# Altium schematic sheet BPS_PowerSupply_v1-0.SchDoc
size A3
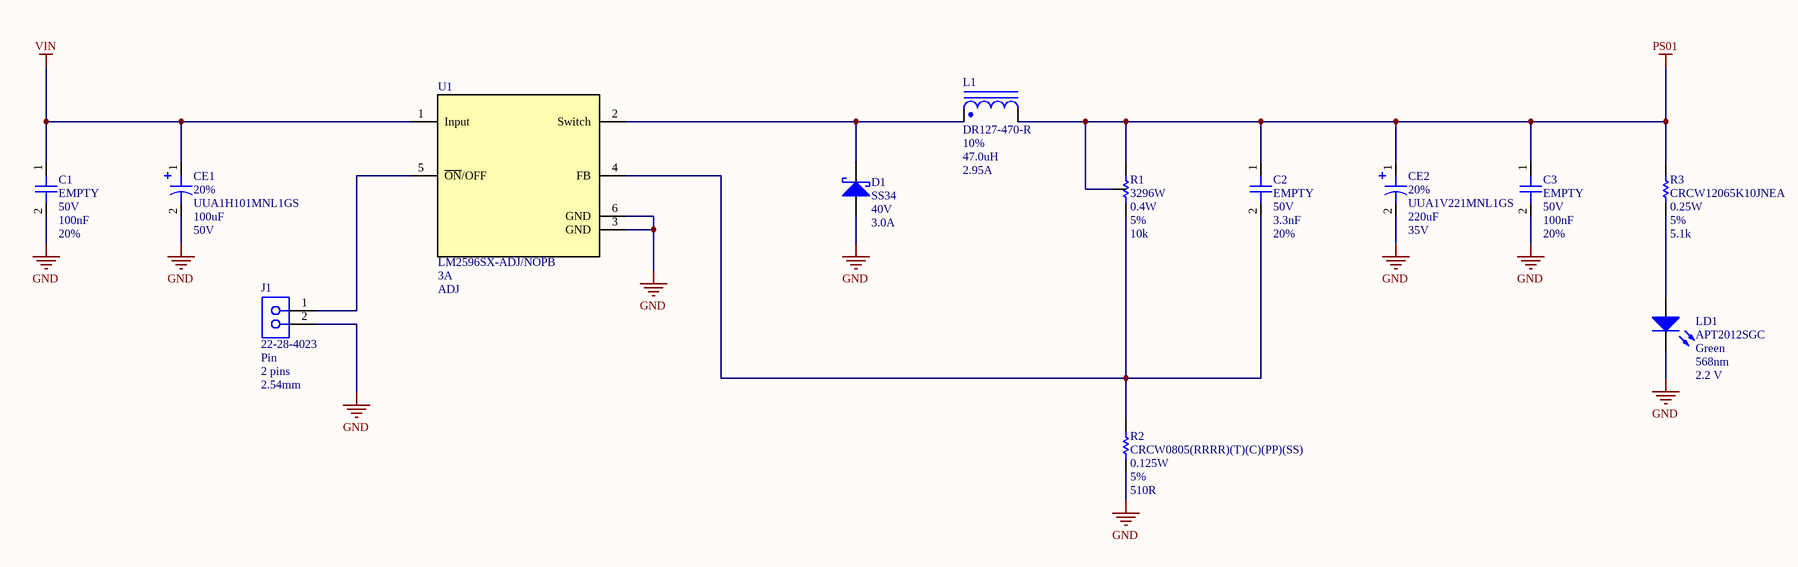
[diagram p0: BPS_PowerSupply_v1-0.SchDoc]

## Parts
C1  value 100nF  PartNumber1: EMPTY  Voltage: 50V  Tolerance: 20%  [Cap0805]  (hidden comment: WCAP-CSGP (0805))
C2  value 3.3nF  PartNumber1: EMPTY  Voltage: 50V  Tolerance: 20%  [Cap0805]  (hidden comment: WCAP-CSGP (0805))
C3  value 100nF  PartNumber1: EMPTY  Voltage: 50V  Tolerance: 20%  [Cap0805]  (hidden comment: WCAP-CSGP (0805))
CE1  value 100uF  Tolerance: 20%  PartNumber1: UUA1H101MNL1GS  Voltage: 50V  [10.0dia(10.0)]  (hidden comment: 50V 100uF)
CE2  value 220uF  Tolerance: 20%  PartNumber1: UUA1V221MNL1GS  Voltage: 35V  [10.0dia(10.0)]  (hidden comment: 35V 220uF)
D1  Vrrm: 40V  If: 3.0A  [DO-214AA]  (hidden comment: SS34)
J1  Type: Pin  Pins: 2 pins  Pitch: 2.54mm  [CONSIL02STRMALE_100_100]  (hidden comment: 22-28-4023)
L1  value 47.0uH  PartNumber1: DR127-470-R  Tolerance: 10%  Current: 2.95A  [DR127]  (hidden comment: DR127)
LD1  Colour: Green  Wavelength: 568nm  Vled: 2.2 V  [LED0805]  (hidden comment: APT2012SGC)
R1  value 10k  Power: 0.4W  Tolerance: 5%  [3296W]  (hidden comment: 3296W)
R2  value 510R  PartNumber1: CRCW0805(RRRR)(T)(C)(PP)(SS)  Power: 0.125W  Tolerance: 5%  [RES0805]  (hidden comment: Chip Resistor)
R3  value 5.1k  PartNumber1: CRCW12065K10JNEA  Power: 0.25W  Tolerance: 5%  [RES1206]  (hidden comment: Chip Resistor)
U1  Current: 3A  Voltage: ADJ  [TO-263-5]  (hidden comment: LM2596SX-ADJ/NOPB)

## Nets
GND: C1.2 C3.2 CE1.2 CE2.2 D1.A J1.2 LD1.K R2.1 U1.3(GND) U1.6(GND)
PS01: C2.1 C3.1 CE2.1 L1.2 R1.2 R1.3 R3.2
VIN: C1.1 CE1.1 U1.1(Input)
NetC2_2: C2.2 R1.1 R2.2 U1.4(FB)
NetD1_K: D1.K L1.1 U1.2(Switch)
NetJ1_1: J1.1 U1.5(~{ON}/OFF)
NetLD1_A: LD1.A R3.1

## Notes on the sheet
- Title
- Author
- Checked By
- Size:
- Revision:
- A3
- Date:
- Project
- Time:
- Sheet
- of
- File:

## Library data of the parts
C1-C3 = WCAP-CSGP (0805): Surface Mount Multilayer Ceramic Chip Capacitors  for Commercial Applications; Manufacturer1: Wurth; Published: 19-Jun-2016; LatestRevisionDate: 19-Jun-2016; Publisher: Lucas Moraes; PackageReference: CAP0805; PackageDescription: CAP0805;2 Leads
CE1 = 50V 100uF: Electrolytic Capacitor SMD; Manufacturer1: Nichicon; Code: 101; Published: 05-Sep-2021; LatestRevisionDate: 05-Sep-2021; PackageReference: 8.0dia(10.0); Publisher: Lucas Moraes; PackageDescription: 10.0dia(10.0)2 leads; LatestRevisionNote: Created
CE2 = 35V 220uF: Electrolytic Capacitor SMD; Manufacturer1: Nichicon; Code: 221; Published: 06-Sep-2021; LatestRevisionDate: 06-Sep-2021; PackageReference: 10.0dia(10.0); Publisher: Lucas Moraes; PackageDescription: 10.0dia(10.0);2 leads; LatestRevisionNote: Created
D1 = SS34: Schottky Barrier Rectifiers 40V 3.0A; Manufacturer1: On Semiconductor; Vf: 0.85V; Published: 24-May-2022; LatestRevisionDate: 20-Jun-2016; PackageReference: DO-214AA; Publisher: Lucas Moraes; PackageDescription: DO-214AA; 2 Leads; PartNumber1: SS34
J1 = 22-28-4023: Headers & Wire Housings 02 MODII HDR SRST B/A .100CL; Manufacturer1: Molex; LastRevisionNote: Created; Gender: Male; Published: 15-Set-2017; LatestRevisionDate: 27-Mar-2023; PackageReference: CONSIL02STRMALE_100_100; Publisher: Lucas Moraes; PackageDescription: CONSIL02STRMALE_100_100; 2 Leads; PartNumber1: 22-28-4023
L1 = DR127: High power density, high efficiency, low profile shielded drum core power inductors; Manufacturer1: Coiltronics / Eaton; LatestRevisionDate: 05-Apr-2023; PackageReference: DR127; Publisher: Lucas Moraes; PackageDescription: DR127; 2 Leads; Published: 05-Apr-2023; Datasheet: https://br.mouser.com/datasheet/2/87/eaton-dr-high-power-density-high-efficiency-shield-1608690.pdf
LD1 = APT2012SGC: Standard LEDs - SMD 0805 Green; Manufacturer1: Kingbright; LastRevisionNote: Created; Published: 29-Dec-2016; PackageReference: LED0805; Publisher: Lucas Moraes; PackageDescription: LED0805; 2 leads; LastRevision: 29-Dec-2016; Datasheet: http://www.us.kingbright.com/images/catalog/SPEC/APT2012SGC.pdf; PartNumber1: APT2012SGC
R1 = 3296W: Trimmer Resistors - Through Hole 3/8" 100Kohms Sealed Vertical Adjust; Manufacturer1: Bourns; Published: 22-May-2017; LatestRevisionDate: 22-May-2017; PackageReference: 3296W; Publisher: Lucas Moraes; PackageDescription: 3386F; 3 Leads; PartNumber1: 3296W
R2 = CRCW0805: Thick Film Chip Resistors with CECC Approval,  available with Established Reliability; LatestRevisionDate: 06-May-2016; PackageReference: 0805; Publisher: Lucas Moraes; PackageDescription: SMD 0805; 2 Leads; Published: 06-May-2016
R3 = CRCW1206: Thick Film Chip Resistors with CECC Approval,  available with Established Reliability; LatestRevisionDate: 06-May-2016; PackageReference: 1206; Publisher: Lucas Moraes; PackageDescription: SMD 1206; 2 Leads; Published: 06-May-2016
U1 = LM2596SX-ADJ/NOPB: Switching Voltage Regulators 4V to 40V, 3A Step-Up Wide Vin Flyback Regulator 5-DDPAK/TO-263 -40 to 125; Manufacturer1: Texas Instruments; Published: 09-Agu-2022; LatestRevisionDate: 09-Agu-2022; LatestRevisionNote: Created; PackageReference: TO-263-5; Publisher: Lucas Moraes; PackageDescription: TO-263-5;5 Leads; PartNumber1: LM2596SX-ADJ/NOPB